# EAGLE design 1-Axis Board - Camera Gantry (EAGLE 6.4)
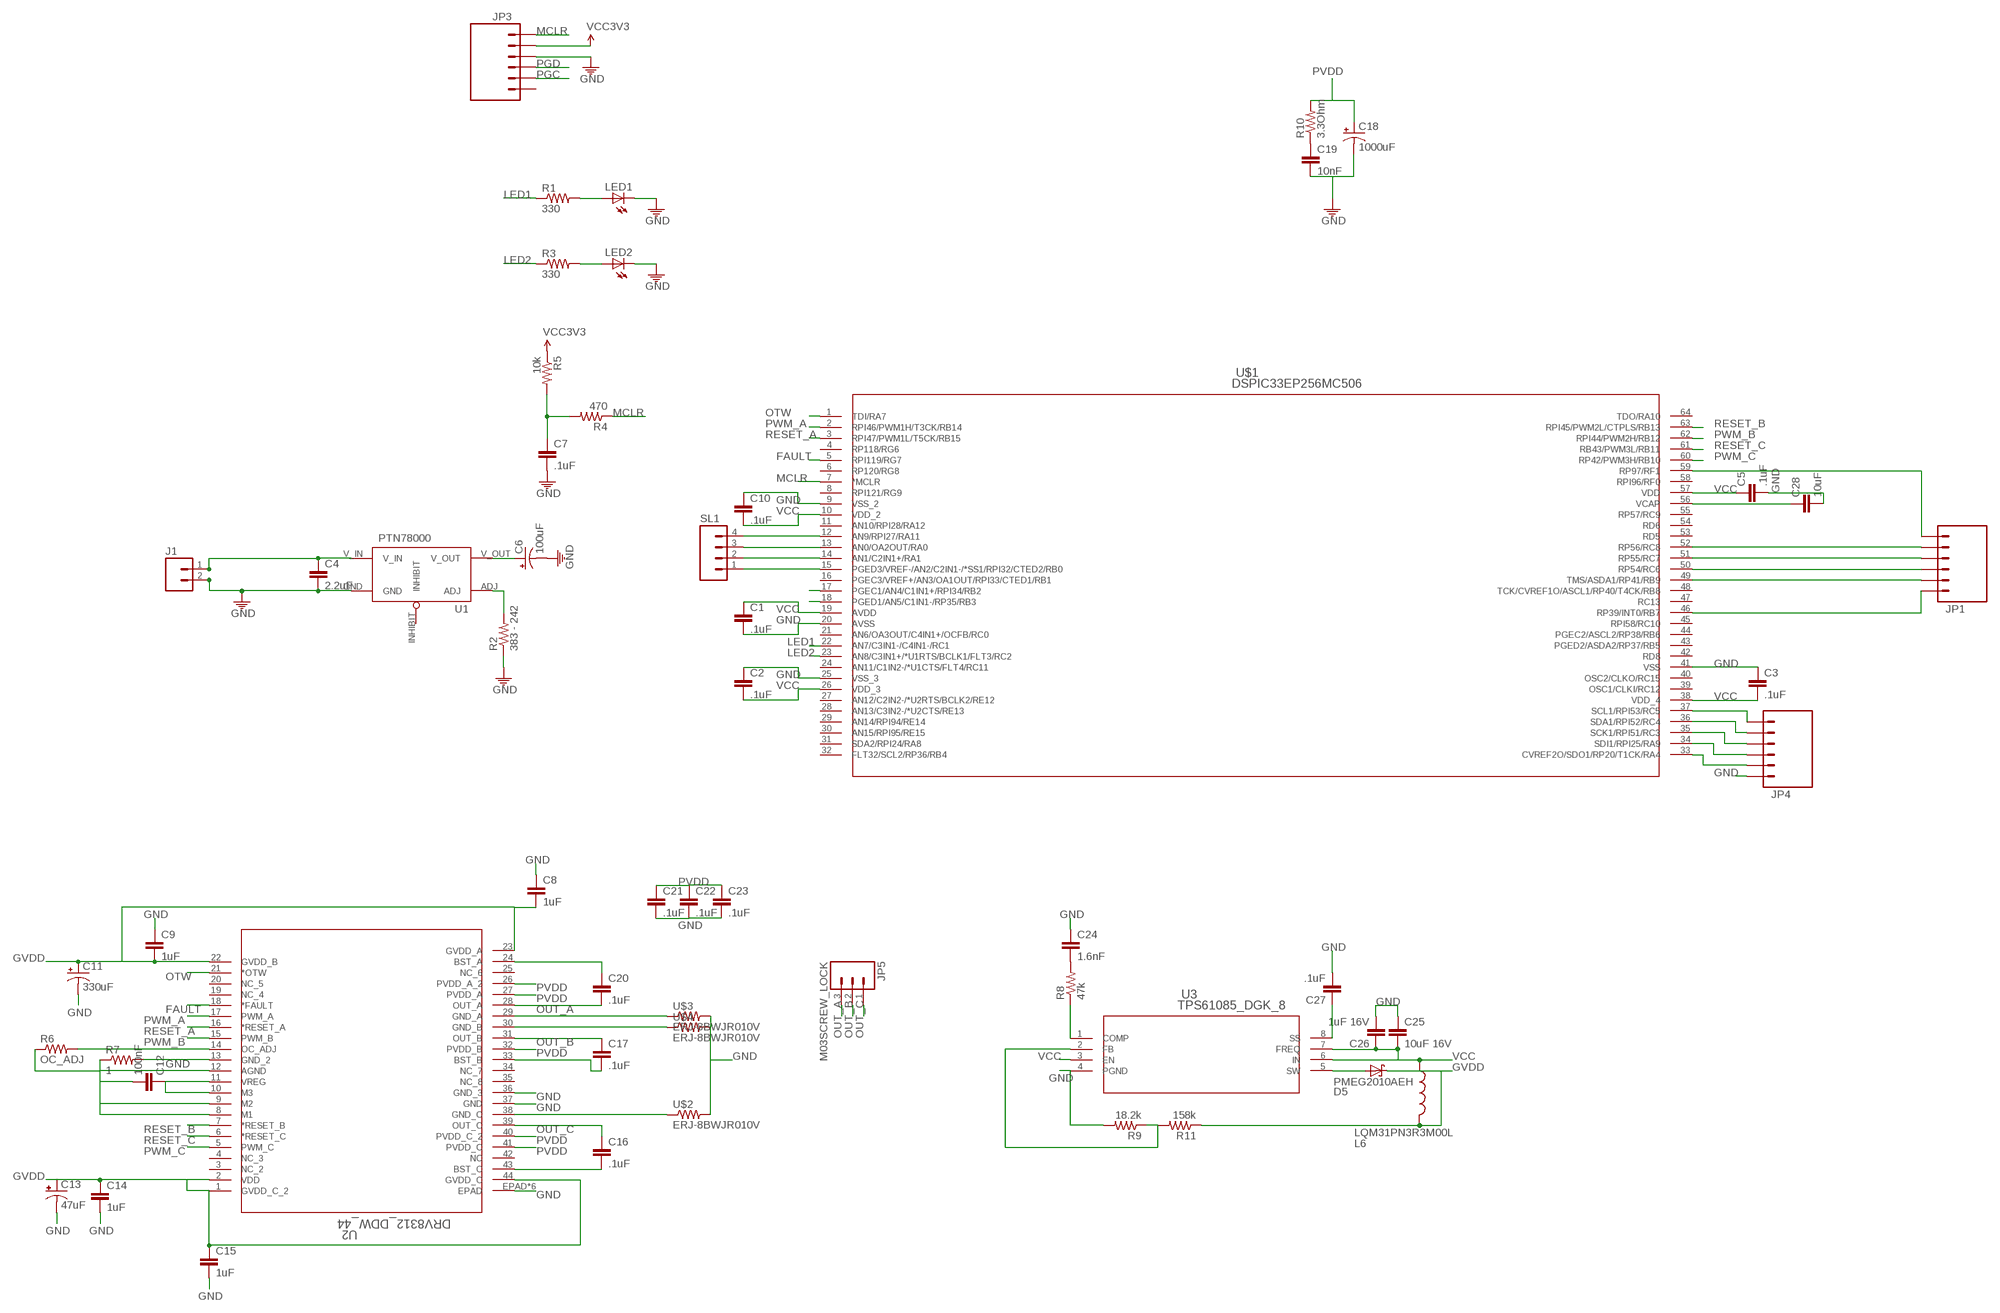
[diagram p0: schematic, sheet 1]

## Parts
C1  .1uF  CAP0805  [0805]
C2  .1uF  CAP0805  [0805]
C3  .1uF  CAP0805  [0805]
C4  2.2uF  CAP1206  [1206]
C5  .1uF  CAP0805  [0805]
C6  100uF  CAP_POLPTH1  [CPOL-RADIAL-100UF-25V]
C7  .1uF  CAP0805  [0805]
C8  1uF  CAP0805  [0805]
C9  1uF  CAP0805  [0805]
C10  .1uF  CAP0805  [0805]
C11  330uF  CAP_POLPTH4  [CPOL-RADIAL-1000UF-25V]
C12  100nF  CAP0805  [0805]
C13  47uF  CAP_POLPTH4  [CPOL-RADIAL-1000UF-25V]
C14  1uF  CAP0805  [0805]
C15  1uF  CAP0805  [0805]
C16  .1uF  CAP0805  [0805]
C17  .1uF  CAP0805  [0805]
C18  1000uF  CAP_POLPTH4  [CPOL-RADIAL-1000UF-25V]
C19  10nF  CAP0805  [0805]
C20  .1uF  CAP0805  [0805]
C21  .1uF  CAP0805  [0805]
C22  .1uF  CAP0805  [0805]
C23  .1uF  CAP0805  [0805]
C24  1.6nF  CAP0805  [0805]
C25  10uF 16V  CAP1206  [1206]
C26  1uF 16V  CAP0805  [0805]
C27  .1uF  CAP0805  [0805]
C28  10uF  CAP1206  [1206]
D5  PMEG2010AEH  [SOD-123]
J1  M023.5MM-NO_SILK  [SCREWTERMINAL-3.5MM-2-NS]
JP1  M06LOCK  [1X06_LOCK]
JP3  M06LOCK  [1X06_LOCK]
JP4  M06LOCK  [1X06_LOCK]
JP5  M03SCREW_LOCK  [SCREWTERMINAL-3.5MM-3_LOCK.007S]
L6  LQM31PN3R3M00L  [1206]
LED1  LED1206  [LED-1206]
LED2  LED1206  [LED-1206]
R1  330  RESISTOR0805-RES  [0805]
R2  383 - 242  RESISTOR0805-RES  [0805]
R3  330  RESISTOR0805-RES  [0805]
R4  470  RESISTOR0805-RES  [0805]
R5  10k  RESISTOR0805-RES  [0805]
R6  OC_ADJ  RESISTOR0805-RES  [0805]
R7  1  RESISTOR0805-RES  [0805]
R8  47k  RESISTOR0805-RES  [0805]
R9  18.2k  RESISTOR0805-RES  [0805]
R10  3.3Ohm  RESISTOR0805-RES  [0805]
R11  158k  RESISTOR0805-RES  [0805]
SL1  M04LOCK  [1X04_LOCK]
U1  PTN78000  PTN78000THROUGH-HOLE  [PTN78000]
U2  DRV8312_DDW_44  [DDW44_8P26X4P31]
U3  TPS61085_DGK_8  [DGK8]
U$1  DSPIC33EP256MC506  [QFP64-10X10MC]
U$2  ERJ-8BWJR010V  [1206]
U$3  ERJ-8BWJR010V  [1206]
U$4  ERJ-8BWJR010V  [1206]

## Nets
FAULT: U2.18(*FAULT) U$1.5(RPI119/RG7)
GND: C1.2 C2.1 C3.1 C4.2 C5.2 C6.2(-) C7.2 C8.1 C9.1 C10.1 C11.2(-) C13.2(-) C14.2 C15.2 C18.2(-) C19.2 C21.2 C22.2 C23.2 C24.1 C25.1 C26.2 C27.2 C28.2 J1.2 JP3.3 JP4.1 LED1.C LED2.C R2.1 R7.2 R9.2 U1.GND U2.13(GND_2) U2.36(GND_3) U2.37(GND) U2.EPAD U2.P$1(EPAD) U2.P$2(EPAD) U2.P$3(EPAD) U2.P$7(EPAD) U2.P$8(EPAD) U3.4(PGND) U$1.9(VSS_2) U$1.20(AVSS) U$1.25(VSS_3) U$1.41(VSS) U$2.2 U$3.2 U$4.2
GVDD: C8.2 C9.2 C11.1(+) C13.1(+) C14.1 C15.1 D5.C L6.2 R11.1 U2.1(GVDD_C_2) U2.2(VDD) U2.22(GVDD_B) U2.23(GVDD_A) U2.44(GVDD_C)
LED1: R1.1 U$1.22(AN7/C3IN1-/C4IN1-/RC1)
LED2: R3.1 U$1.23(AN8/C3IN1+/*U1RTS/BCLK1/FLT3/RC2)
MCLR: JP3.1 R4.1 U$1.7(*MCLR)
N$1: LED1.A R1.2
N$2: C7.1 R4.2 R5.2
N$3: LED2.A R3.2
N$4: U2.38(GND_C) U$2.1
N$5: U2.29(GND_A) U$3.1
N$6 [power]: R2.2 U1.ADJ
N$7: U2.30(GND_B) U$4.1
N$10: C27.1 U3.8(SS)
N$11: R8.1 U3.1(COMP)
N$12: C24.2 R8.2
N$13: C19.1 R10.1
N$14: C28.1 U$1.56(VCAP)
N$15: D5.A U3.5(SW)
N$16: R9.1 R11.2 U3.2(FB)
N$21: C16.2 U2.43(BST_C)
N$23: JP1.1 U$1.46(RP39/INT0/RB7)
N$24: JP1.2 U$1.49(TMS/ASDA1/RP41/RB9)
N$25: JP1.3 U$1.50(RP54/RC6)
N$27: JP1.5 U$1.52(RP56/RC8)
N$28: JP1.6 U$1.59(RP97/RF1)
N$30: C17.2 U2.33(BST_B)
N$32: JP1.4 U$1.51(RP55/RC7)
N$35: JP4.4 U$1.35(SCK1/RPI51/RC3)
N$36: JP4.5 U$1.36(SDA1/RPI52/RC4)
N$37: JP4.6 U$1.37(SCL1/RPI53/RC5)
N$38: JP4.3 U$1.34(SDI1/RPI25/RA9)
N$39: C20.1 U2.24(BST_A)
N$40: SL1.1 U$1.15(PGED3/VREF-/AN2/C2IN1-/*SS1/RPI32/CTED2/RB0)
N$41: SL1.2 U$1.14(AN1/C2IN1+/RA1)
N$42: SL1.3 U$1.13(AN0/OA2OUT/RA0)
N$43: SL1.4 U$1.12(AN9/RPI27/RA11)
N$44: JP4.2 U$1.33(CVREF2O/SDO1/RP20/T1CK/RA4)
N$45: C12.2 R6.1 R7.1 U2.8(M1) U2.9(M2) U2.12(AGND)
N$47: C12.1 U2.10(M3) U2.11(VREG)
OC_ADJ: R6.2 U2.14(OC_ADJ)
OTW: U2.21(*OTW) U$1.1(TDI/RA7)
OUT_A: C20.2 JP5.3 U2.28(OUT_A)
OUT_B: C17.1 JP5.2 U2.31(OUT_B)
OUT_C: C16.1 JP5.1 U2.39(OUT_C)
PGC: JP3.5 U$1.17(PGEC1/AN4/C1IN1+/RPI34/RB2)
PGD [small]: JP3.4 U$1.18(PGED1/AN5/C1IN1-/RP35/RB3)
PVDD [power]: C4.1 C18.1(+) C21.1 C22.1 C23.1 J1.1 R10.2 U1.V_IN U2.26(PVDD_A_2) U2.27(PVDD_A) U2.32(PVDD_B) U2.40(PVDD_C_2) U2.41(PVDD_C)
PWM_A: U2.17(PWM_A) U$1.2(RPI46/PWM1H/T3CK/RB14)
PWM_B: U2.15(PWM_B) U$1.62(RPI44/PWM2H/RB12)
PWM_C: U2.5(PWM_C) U$1.60(RP42/PWM3H/RB10)
RESET_A: U2.16(*RESET_A) U$1.3(RPI47/PWM1L/T5CK/RB15)
RESET_B: U2.7(*RESET_B) U$1.63(RPI45/PWM2L/CTPLS/RB13)
RESET_C: U2.6(*RESET_C) U$1.61(RB43/PWM3L/RB11)
VCC: C1.1 C2.2 C3.2 C5.1 C6.1(+) C10.2 C25.2 C26.1 L6.1 U1.V_OUT U3.3(EN) U3.6(IN) U3.7(FREQ) U$1.10(VDD_2) U$1.19(AVDD) U$1.26(VDD_3) U$1.38(VDD_4) U$1.57(VDD)
VCC3V3: JP3.2 R5.1
Unconnected: JP3.6 U1.INHIBIT U2.3(NC_2) U2.4(NC_3) U2.19(NC_4) U2.20(NC_5) U2.25(NC_6) U2.34(NC_7) U2.35(NC_8) U2.42(NC) U$1.4(RP118/RG6) U$1.6(RP120/RG8) U$1.8(RPI121/RG9) U$1.11(AN10/RPI28/RA12) U$1.16(PGEC3/VREF+/AN3/OA1OUT/RPI33/CTED1/RB1) U$1.21(AN6/OA3OUT/C4IN1+/OCFB/RC0) U$1.24(AN11/C1IN2-/*U1CTS/FLT4/RC11) U$1.27(AN12/C2IN2-/*U2RTS/BCLK2/RE12) U$1.28(AN13/C3IN2-/*U2CTS/RE13) U$1.29(AN14/RPI94/RE14) U$1.30(AN15/RPI95/RE15) U$1.31(SDA2/RPI24/RA8) U$1.32(FLT32/SCL2/RP36/RB4) U$1.39(OSC1/CLKI/RC12) U$1.40(OSC2/CLKO/RC15) U$1.42(RD8) U$1.43(PGED2/ASDA2/RP37/RB5) U$1.44(PGEC2/ASCL2/RP38/RB6) U$1.45(RPI58/RC10) U$1.47(RC13) U$1.48(TCK/CVREF1O/ASCL1/RP40/T4CK/RB8) U$1.53(RD5) U$1.54(RD6) U$1.55(RP57/RC9) U$1.58(RPI96/RF0) U$1.64(TDO/RA10)

## Library data of the parts
C1-C3 C5 C7-C10 C12 C14-C17 C19-C28 = ASL:CAP: Capacitor Standard 0603 ceramic capacitor, and 0.1" leaded capacitor.
C4 = CMPE118lib:CAP: Capacitor Standard 0603 ceramic capacitor, and 0.1" leaded capacitor.
C6 C11 C13 C18 = ASL:CAP_POL: Capacitor Polarized These are standard SMD and PTH capacitors. Normally 10uF, 47uF, and 100uF in electrolytic and tantalum varieties. Always verify the external diameter of the through hole cap, it varies with capacity, voltage, and manufacturer. The EIA devices should be standard.
D5 = DRV83x2Support:PMEG2010AEH
J1 = ASL:M02: Header 2 Standard 2-pin 0.1" header. Use with straight break away headers (SKU : PRT-00116), right angle break away headers (PRT-00553), swiss pins (PRT-00743), machine pins (PRT-00117), and female headers (PRT-00115). Molex polarized connector foot print use with SKU : PRT-08233 with associated crimp pins and housings.
JP1 JP4 = ASL:M06: Header 6 Standard 6-pin 0.1" header. Use with straight break away headers (SKU : PRT-00116), right angle break away headers (PRT-00553), swiss pins (PRT-00743), machine pins (PRT-00117), and female headers (PRT-00115). Molex polarized connector foot print use with SKU : PRT-08094 with associated crimp pins and housings. NOTES ON THE VARIANTS LOCK and LOCK_LONGPADS... This footprint was designed to help hold the alignment of a through-hole component (i.e. 6-pin header) while soldering it into place. You may notice that each hole has been shifted either up or down by 0.005 of an inch from it's more standard position (which is a perfectly straight line). This slight alteration caused the pins (the squares in the middle) to touch the edges of the holes. Because they are alternating, it causes a "brace" to hold the component in place. 0.005 has proven to be the perfect amount of "off-center" position when using our standard breakaway headers. Although looks a little odd when you look at the bare footprint, once you have a header in there, the alteration is very hard to notice. Also, if you push a header all the way into place, it is covered up entirely on the bottom side. This idea of altering the position of holes to aid alignment will be further integrated into the Sparkfun Library for other footprints. It can help hold any component with 3 or more connection pins.
JP3 = CMPE118lib:M06: Header 6 Standard 6-pin 0.1" header. Use with straight break away headers (SKU : PRT-00116), right angle break away headers (PRT-00553), swiss pins (PRT-00743), machine pins (PRT-00117), and female headers (PRT-00115). Molex polarized connector foot print use with SKU : PRT-08094 with associated crimp pins and housings. NOTES ON THE VARIANTS LOCK and LOCK_LONGPADS... This footprint was designed to help hold the alignment of a through-hole component (i.e. 6-pin header) while soldering it into place. You may notice that each hole has been shifted either up or down by 0.005 of an inch from it's more standard position (which is a perfectly straight line). This slight alteration caused the pins (the squares in the middle) to touch the edges of the holes. Because they are alternating, it causes a "brace" to hold the component in place. 0.005 has proven to be the perfect amount of "off-center" position when using our standard breakaway headers. Although looks a little odd when you look at the bare footprint, once you have a header in there, the alteration is very hard to notice. Also, if you push a header all the way into place, it is covered up entirely on the bottom side. This idea of altering the position of holes to aid alignment will be further integrated into the Sparkfun Library for other footprints. It can help hold any component with 3 or more connection pins.
JP5 = ASL:M03: Header 3 Standard 3-pin 0.1" header. Use with straight break away headers (SKU : PRT-00116), right angle break away headers (PRT-00553), swiss pins (PRT-00743), machine pins (PRT-00117), and female headers (PRT-00115). Molex polarized connector foot print use with SKU : PRT-08232 with associated crimp pins and housings.
L6 = DRV83x2Support:LQM31PN3R3M00L
LED1 LED2 = CMPE118lib:LED: LEDs Standard schematic elements and footprints for 5mm, 3mm, 1206, and 0603 sized LEDs. 5mm - Spark Fun Electronics SKU : COM-00529 (and others); COLOR: red
R1-R5 = CMPE118lib:RESISTOR: Resistor Basic schematic elements and footprints for 0603, 1206, and PTH resistors.
R6-R11 = ASL:RESISTOR: Resistor Basic schematic elements and footprints for 0603, 1206, and PTH resistors.
SL1 = ASL:M04: AMP QUICK CONNECTOR
U1 = ASL:PTN78000: This is the PTN78000 part by Texas Instruments. It's a 1.5A adjustable switching regulator.
U2 = DRV83x2Support:DRV8312_DDW_44; DATASHEETURL: http://www.ti.com/lit/gpn/DRV8312; DESCRIPTION: 6.5A Three Phase Brushless DC Motor Driver with Inrush Protection (PWM Ctrl); FAMILY_NAME: 3-PHASE BRUSHLESS DRIVER; GENERIC_PART_NUMBER: DRV8312; INDUSTRY_STD_PKG_TYPE: HTSSOP; MANUFACTURER: Texas Instruments; MANUFACTURER_PART_NUMBER: drv8312_ddw_44; PACKAGE_DESIGNATOR: DDW; PIN_COUNT: 44; VENDOR: Texas Instruments
U3 = DRV83x2Support:TPS61085_DGK_8; DATASHEETURL: http://www.ti.com/lit/gpn/TPS61085; DESCRIPTION: 18.5V, 2A, 650kHz / 1.2MHz Step-Up DC-DC Converter w/ Forced PWM Mode; FAMILY_NAME: STEP-UP REGULATOR; GENERIC_PART_NUMBER: TPS61085; INDUSTRY_STD_PKG_TYPE: MSOP; MANUFACTURER: Texas Instruments; MANUFACTURER_PART_NUMBER: tps61085_dgk_8; PACKAGE_DESIGNATOR: DGK; PIN_COUNT: 8; VENDOR: Texas Instruments
U$1 = DRV83x2Support:DSPIC33EP256MC506
U$2-U$4 = DRV83x2Support:ERJ-8BWJR010V

## Net classes
0 default: width 0.406 mm
1 power: width 0.762 mm, clearance 0.254 mm to class 0, clearance 0.508 mm
2 small: width 0.254 mm, clearance 0.254 mm to class 1

## Board
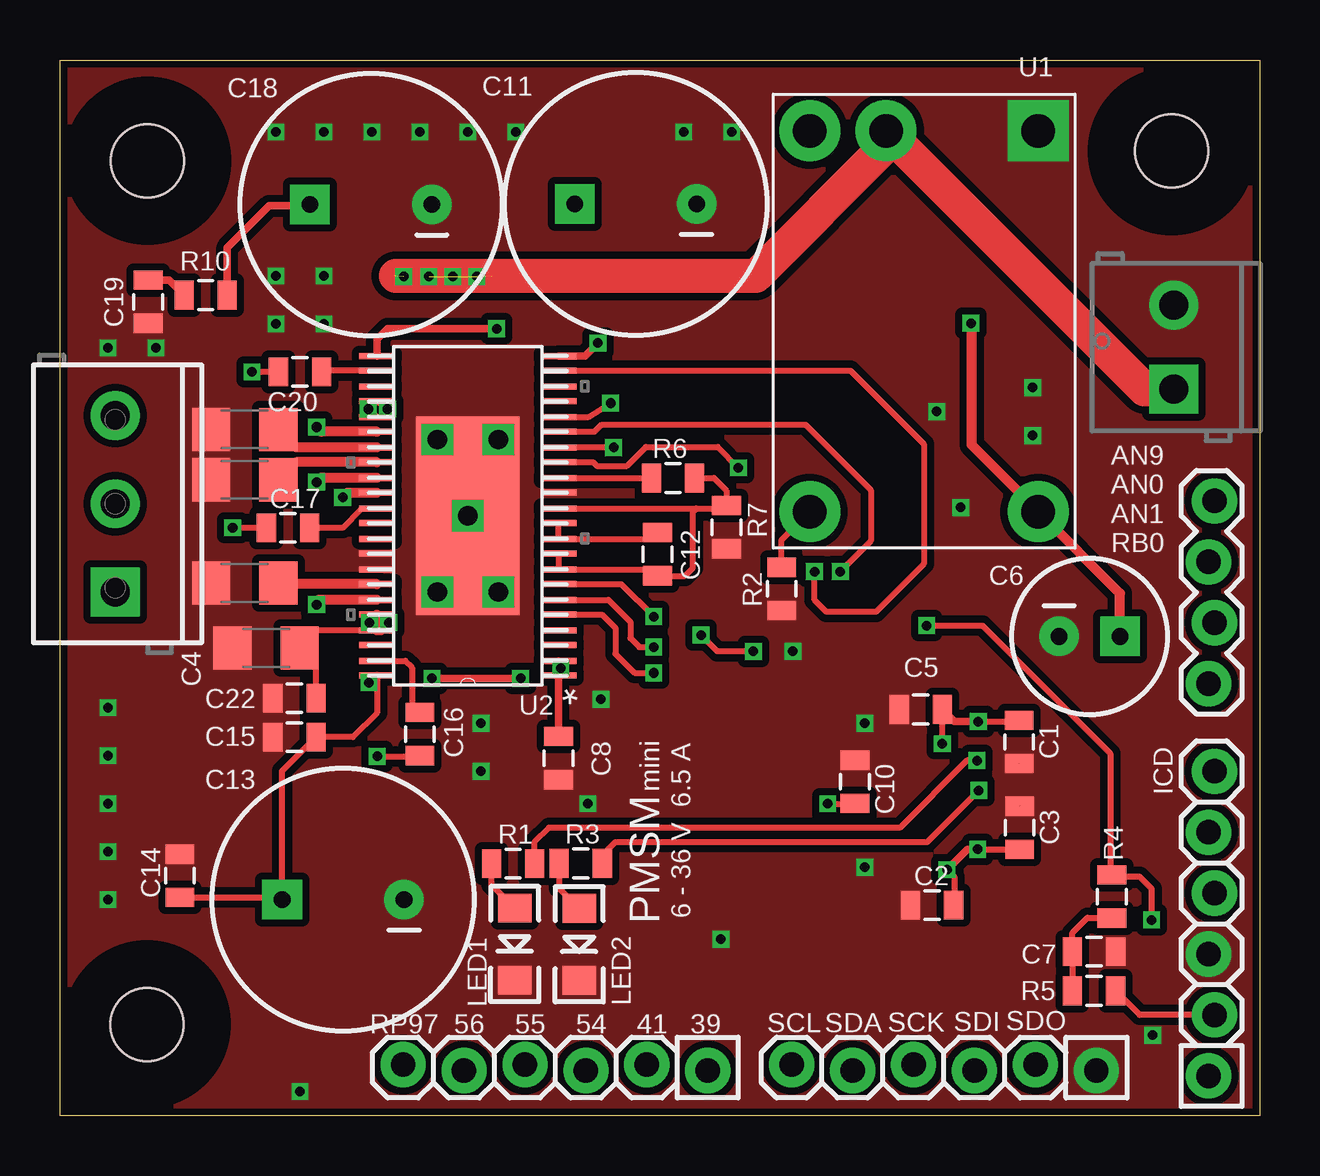
[diagram p1: board, top side]
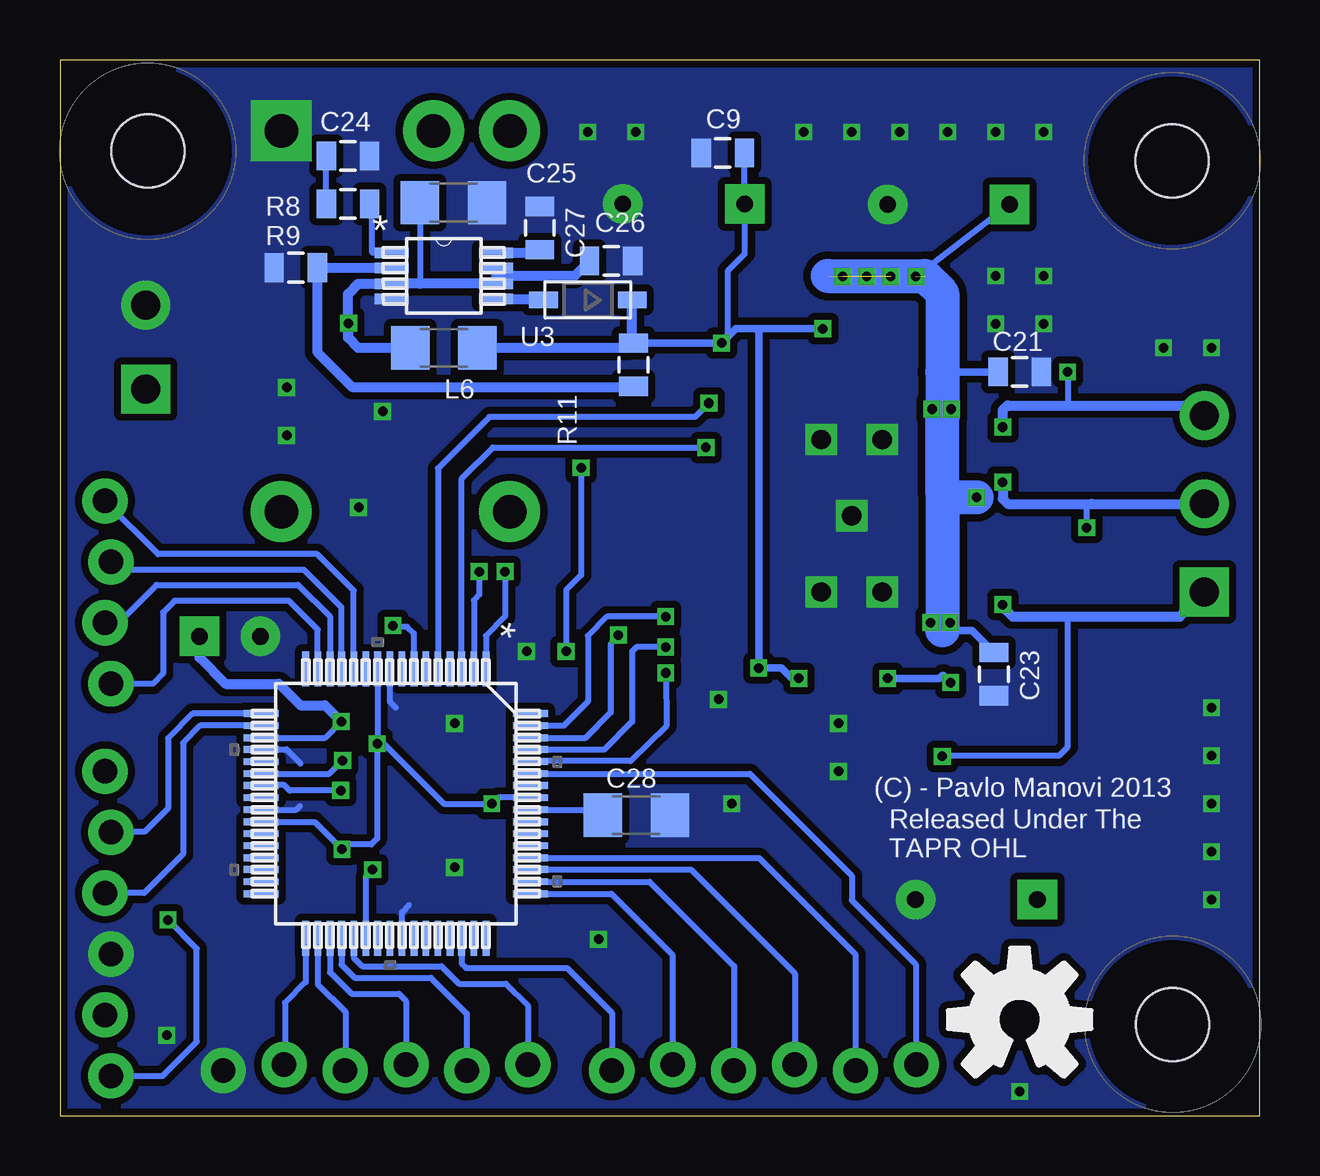
[diagram p2: board, bottom side, seen from below]

Size 50 x 44 mm. Coordinates in mm from the lower left corner, seen from the top.
Outline: 0,0 0,44 50,44 50,0 0,0
Copper layers (1*16): Top 0.035mm / dielectric 1.5mm / Bottom 0.035mm
Design rules "ITEADstudio_DRC": minimum track width 6mil, minimum drill 12mil, track to track 6mil, track to pad 6mil, pad to pad 6mil, via to via 6mil, smd to smd 0mil, copper to edge 10mil, drill to drill 10mil, minimum pad ring 10mil, minimum via ring 6mil, stop-mask expansion 2mil, vias tented up to drill 100mil, thermal gap 10mil

### Footprints (pad centres in the part's own frame; a part is rotated, then mirrored left to right if it is on the bottom)
0805 = smd 0.8 x 1.2: 1 -0.9,0; 2 0.9,0
1206 = smd 1.6 x 1.8: 1 -1.4,0; 2 1.4,0
CPOL-RADIAL-100UF-25V = drill 0.7 pad 1.651 square: 1 1.27,0 | drill 0.7 pad 1.651: 2 -1.27,0
CPOL-RADIAL-1000UF-25V = drill 0.7 pad 1.651 square: 1 2.54,0 | drill 0.7 pad 1.651: 2 -2.54,0
SOD-123 = smd 1.2 x 0.7: A 1.85,0; C -1.85,0
STAND-OFF-TIGHT = hole 3.048: 0,0
SCREWTERMINAL-3.5MM-2-NS = drill 1.2 pad 2.032 square: 1 0,0 | drill 1.2 pad 2.032: 2 3.5,0
1X06_LOCK = drill 1.016 pad 1.88: 1 0,0.127; 2 2.54,-0.127; 3 5.08,0.127; 4 7.62,-0.127; 5 10.16,0.127; 6 12.7,-0.127
SCREWTERMINAL-3.5MM-3_LOCK.007S = drill 1.2 pad 2.032 square: 1 -0.178,0 | drill 1.2 pad 2.032: 2 3.5,0; 3 7.178,0
LED-1206 = smd 1.2 x 1.4: A -1.5,0; C 1.5,0
1X04_LOCK = drill 1.016 pad 1.88: 1 0,0.127; 2 2.54,-0.127; 3 5.08,0.127; 4 7.62,-0.127
PTN78000 = drill 1.397 pad 2.54: ADJ 15.875,-9.525; INHIBIT 0,-9.525; V_IN 0,-6.35; V_OUT 15.875,0 | drill 1.397 pad 2.54 square: GND 0,0
DDW44_8P26X4P31 = smd 1.473 x 0.254: 1 -3.785,6.655; 2 -3.785,6.045; 3 -3.785,5.385; 4 -3.785,4.775; 5 -3.785,4.115; 6 -3.785,3.505; 7 -3.785,2.845; 8 -3.785,2.235; 9 -3.785,1.575; 10 -3.785,0.965; 11 -3.785,0.305; 12 -3.785,-0.305; 13 -3.785,-0.965; 14 -3.785,-1.575; 15 -3.785,-2.235; 16 -3.785,-2.845; 17 -3.785,-3.505; 18 -3.785,-4.115; 19 -3.785,-4.775; 20 -3.785,-5.385; 21 -3.785,-6.045; 22 -3.785,-6.655; 23 3.785,-6.655; 24 3.785,-6.045; 25 3.785,-5.385; 26 3.785,-4.775; 27 3.785,-4.115; 28 3.785,-3.505; 29 3.785,-2.845; 30 3.785,-2.235; 31 3.785,-1.575; 32 3.785,-0.965; 33 3.785,-0.305; 34 3.785,0.305; 35 3.785,0.965; 36 3.785,1.575; 37 3.785,2.235; 38 3.785,2.845; 39 3.785,3.505; 40 3.785,4.115; 41 3.785,4.775; 42 3.785,5.385; 43 3.785,6.045; 44 3.785,6.655 | smd 4.318 x 8.255: EPAD 0,0 | drill 0.8 square: P$1 -1.27,3.175; P$2 1.27,3.175; P$3 0,0; P$7 1.27,-3.175; P$8 -1.27,-3.175
DGK8 = smd 1.422 x 0.432: 1 -2.184,0.965; 2 -2.184,0.33; 3 -2.184,-0.33; 4 -2.184,-0.965; 5 2.184,-0.965; 6 2.184,-0.33; 7 2.184,0.33; 8 2.184,0.965
QFP64-10X10MC = smd 1.473 x 0.279: 1 -5.613,3.759; 2 -5.613,3.251; 3 -5.613,2.743; 4 -5.613,2.261; 5 -5.613,1.753; 6 -5.613,1.245; 7 -5.613,0.762; 8 -5.613,0.254; 9 -5.613,-0.254; 10 -5.613,-0.762; 11 -5.613,-1.245; 12 -5.613,-1.753; 13 -5.613,-2.261; 14 -5.613,-2.743; 15 -5.613,-3.251; 16 -5.613,-3.759; 33 5.613,-3.759; 34 5.613,-3.251; 35 5.613,-2.743; 36 5.613,-2.261; 37 5.613,-1.753; 38 5.613,-1.245; 39 5.613,-0.762; 40 5.613,-0.254; 41 5.613,0.254; 42 5.613,0.762; 43 5.613,1.245; 44 5.613,1.753; 45 5.613,2.261; 46 5.613,2.743; 47 5.613,3.251; 48 5.613,3.759 | smd 0.279 x 1.473: 17 -3.759,-5.613; 18 -3.251,-5.613; 19 -2.743,-5.613; 20 -2.261,-5.613; 21 -1.753,-5.613; 22 -1.245,-5.613; 23 -0.762,-5.613; 24 -0.254,-5.613; 25 0.254,-5.613; 26 0.762,-5.613; 27 1.245,-5.613; 28 1.753,-5.613; 29 2.261,-5.613; 30 2.743,-5.613; 31 3.251,-5.613; 32 3.759,-5.613; 49 3.759,5.613; 50 3.251,5.613; 51 2.743,5.613; 52 2.261,5.613; 53 1.753,5.613; 54 1.245,5.613; 55 0.762,5.613; 56 0.254,5.613; 57 -0.254,5.613; 58 -0.762,5.613; 59 -1.245,5.613; 60 -1.753,5.613; 61 -2.261,5.613; 62 -2.743,5.613; 63 -3.251,5.613; 64 -3.759,5.613

### Placement (x,y rotation side)
C1  39.98,15.57 270 top
C2  36.35,8.78 0 top
C3  40,12 270 top
C4  8.59,19.49 180 top
C5  35.88,16.93 180 top
C6  42.92,19.97 0 top
C7  43.1,6.84 0 top
C8  20.77,14.9 90 top
C9  22.38,40.12 0 bottom
C10  33.13,13.91 270 top
C11  24,38 180 top
C12  24.9,23.4 270 top
C13  11.8,9 180 top
C14  5,10 90 top
C15  9.77,15.77 180 top
C16  15,15.9 90 top
C17  9.5,24.5 0 top
C18  12.96,37.98 180 top
C19  3.67,33.92 270 top
C20  10,31 180 top
C21  10,31 0 bottom
C22  9.77,17.4 180 top
C23  11.08,18.4 270 bottom
C24  38,40 180 bottom
C25  33.6,38.05 180 bottom
C26  27.02,35.62 0 bottom
C27  30,37 90 bottom
C28  25.98,12.53 0 bottom
D5  28,34 180 bottom
E$1  [STAND-OFF-TIGHT]  46.34,40.2 0 top
E$3  [STAND-OFF-TIGHT]  3.62,3.8 0 top
E$4  [STAND-OFF-TIGHT]  3.64,39.8 0 top
J1  46.43,30.28 90 top
JP1  27,2 180 top
JP3  48,1.65 90 top
JP4  43.2,2 180 top
JP5  2.3,22 90 top
L6  34,32 0 bottom
LED1  18.95,7.15 270 top
LED2  21.64,7.13 270 top
R1  18.88,10.5 180 top
R2  30.08,21.95 90 top
R3  21.7,10.51 180 top
R4  43.84,9.13 270 top
R5  43.1,5.2 180 top
R6  25.55,26.57 180 top
R7  27.77,24.52 270 top
R8  38,38 180 bottom
R9  40.17,35.35 180 bottom
R10  6.07,34.2 0 top
R11  26.1,31.3 270 bottom
SL1  48,18 90 top
U1  40.78,41.05 270 top
U2  17,25 180 top
U3  34,35 0 bottom
U$1  36,13 270 bottom
U$2  7.7,22.2 180 top
U$3  7.7,28.6 180 top
U$4  7.7,26.5 180 top

### Tracks (layer width: path | path; a pad name or v marks a point on that pad's centre or on a via)
FAULT  (via drill 0.4)
  Top 0.254: U2.18 22.04,29.11 v22.95,29.7
  Bottom 0.254: U$1.5 34.25,26.98 32.1,29.12 23.52,29.12 v22.95,29.7
GND  (via drill 0.4)  (2 unrouted)
  Bottom 0.254: U$1.20 40.56,15.26 C1.2 | U$1.25 40.15,12.75 C3.1 | U$1.41 35.75,8.48 C2.1 | U$1.9 36.25,17.25 36,17
  other vias: 11,41 13,41 15,41 9,41 17,41 19,41 26,41 28,41 11,35 9,35 9,33 11,33 2,32 4,32 2,17 2,15 2,13 2,11 2,9 10,1 45.55,3.35 40.55,28.35 40.55,30.35 36.55,29.35 37.55,25.35 30.55,19.35 33.55,16.35 33.55,10.35 27.55,7.35 17.55,16.35 17.55,14.35 22.55,17.35 22,13
  pour Top (isolate 0.305, no thermals): 0,44 50,44 50,0 0,0
  pour Bottom (isolate 0.305, no thermals): 0,44 50,44 50,0 0,0
GVDD  (via drill 0.4)
  Top 0.254: U2.44 13.22,16.79 12.2,15.77 C15.1 9.26,14.36 C13.1 9.16,9.1 C14.1
  Top 0.305: U2.22 21.88,31.66 v22.42,32.2 | U2.23 13.22,32.37 13.65,32.8 v18.2,32.8 | C8.2 U2.2 | U2.1 U2.2 | v12.88,18.05 12.92,18.05 U2.44 | v20.88,18.65 20.88,18.86 U2.2 | v19.2,18.23 v15.5,18.23
  Bottom 0.254: C9.2 21.46,40.11 C11.1 21.45,35.92 22.15,35.23 22.15,32.48
  Bottom 0.305: v22.42,32.2 R11.1 | 22.15,32.48 v22.42,32.2 | v18.2,32.8 21,32.8 | 21,32.8 21.83,32.8 v22.42,32.2 | v19.2,18.23 19.5,18.23 19.92,18.65 v20.88,18.65 20.88,32.67 21,32.8 | v15.5,18.23 13.34,18.23 U2.44 13.17,18.34 v12.88,18.05
  Bottom 0.406: D5.C 26.15,32.25 R11.1 26.3,32 L6.2
LED1  (via drill 0.4)
  Top 0.254: v38.23,14.8 37.8,14.8 35,12 20.38,12 19.78,11.41 R1.1
  Bottom 0.254: U$1.22 38.78,14.25 v38.23,14.8
LED2  (via drill 0.4)
  Top 0.254: R3.1 22.6,10.86 23.15,11.4 36.15,11.4 v38.3,13.55
  Bottom 0.254: v38.3,13.55 40.42,13.55 40.65,13.78 41.6,13.78 U$1.23
MCLR  (via drill 0.4)
  Top 0.254: v45.5,8.15 45.5,9.45 45,9.95 43.92,9.95 R4.1 43.78,10.1 43.78,15.1 38.45,20.43 v36.12,20.43
  Bottom 0.254: JP3.1 45.72,1.65 44.3,3.08 44.3,6.95 v45.5,8.15 | U$1.7 35.25,18.62 35.25,20.1 35.52,20.38 36.08,20.38 v36.12,20.43
N$1
  Top 0.254: LED1.A 17.98,9.62 R1.2
N$2
  Top 0.254: R5.2 C7.1 42.2,7.62 42.83,8.25 43.82,8.25 R4.2
N$3
  Top 0.254: R3.2 20.8,9.47 LED2.A
N$4
  Top 0.406: U2.38 9.14,22.16 U$2.1
N$5
  Top 0.406: U2.29 9.86,27.84 U$3.1
N$6
  Top 0.254: R2.2 30.08,24 U1.ADJ
N$7
  Top 0.406: U2.30 9.84,27.23 U$4.1
N$8
  Bottom 0.2: 9.21,2.09 arc-9 8.91,2.25 8.15,1.64 7.64,2.15 8.25,2.91 arc-19 7.99,3.54 7.02,3.63 7.02,4.37 7.99,4.46 arc-19 8.25,5.09 7.64,5.85 8.15,6.36 8.91,5.75 arc-19 9.54,6.01 9.63,6.98 10.37,6.98 10.46,6.01 arc-19 11.09,5.75 11.85,6.36 12.36,5.85 11.75,5.09 arc-19 12.01,4.46 12.98,4.37 12.98,3.63 12.01,3.54 arc-19 11.75,2.91 12.36,2.15 11.85,1.64 11.09,2.25 arc-9 10.79,2.09 10.36,3.13 arc68 10.94,4 arc248 9.64,3.13 9.21,2.09
N$10
  Bottom 0.406: U3.8 30.13,35.97 C27.1
N$11
  Bottom 0.254: U3.1 36.97,35.97 37,36 37,37.9 R8.1
N$12
  Bottom 0.254: R8.2 C24.2
N$13
  Top 0.305: C19.1 4.56,34.82 R10.1
N$14
  Bottom 0.254: U$1.56 27.65,12.75 C28.1
N$15
  Bottom 0.406: U3.5 29.88,34.03 D5.A
N$16
  Bottom 0.406: U3.2 39.26,35.33 R9.1 39.27,31.83 37.83,30.38 26.12,30.38 R11.2
N$21
  Top 0.254: U2.43 14.4,18.95 14.67,18.68 14.67,17.12 C16.2
N$23
  Bottom 0.254: U$1.46 33.26,6.33 33.08,6.15 28.88,6.15 27,4.28 JP1.1
N$24
  Bottom 0.254: U$1.49 27.02,9.24 24.48,6.7 24.48,2.14 JP1.2
N$25
  Bottom 0.254: U$1.50 25.42,9.75 21.9,6.22 21.9,1.89 JP1.3
N$27
  Bottom 0.254: U$1.52 20.86,10.74 16.85,6.72 16.85,1.88 JP1.5
N$28
  Bottom 0.254: U$1.59 21.24,14.25 17,10 17,8.97 14.33,6.3 14.33,2.15 JP1.6
N$30
  Top 0.254: C17.2 11.77,24.5 12.58,25.3 U2.33
N$32
  Bottom 0.254: U$1.51 23.71,10.26 19.38,5.92 JP1.4
N$35
  Bottom 0.254: U$1.35 38.74,5.97 37.85,5.08 35.88,5.08 35.58,4.78 JP4.4
N$36
  Bottom 0.254: U$1.36 38.26,6.29 37.73,5.75 34.55,5.75 33.05,4.25 33.05,1.88 JP4.5
N$37
  Bottom 0.254: U$1.37 37.75,6.58 37.4,6.22 34.1,6.22 33.38,5.5 31.42,5.5 30.5,4.58 JP4.6
N$38
  Bottom 0.254: U$1.34 39.25,5.48 38.1,4.33 38.1,1.89 JP4.3
N$39
  Top 0.254: U2.24 10.95,31.05 C20.1
N$40
  Bottom 0.254: U$1.15 39.25,20.25 40.45,21.45 45.22,21.45 45.7,20.98 45.7,18.43 46.12,18 SL1.1
N$41
  Bottom 0.254: SL1.2 47.56,20.54 45.97,22.12 40.08,22.12 38.75,20.8 U$1.14
N$42
  Bottom 0.254: U$1.13 38.26,21.19 39.83,22.75 47.54,22.75 SL1.3
N$43
  Bottom 0.254: U$1.12 37.75,21.88 39.27,23.4 45.91,23.4 SL1.4
N$44
  Bottom 0.254: U$1.33 39.76,5.57 40.62,4.7 40.62,2.16 JP4.2
N$45
  Top 0.254: U2.9 U2.8 24.63,22.77 C12.2 26.05,22.5 26.38,22.82 26.38,25.16 26.52,25.3 | R6.1 27.25,26.57 27.77,26.05 R7.1 27.66,25.3 26.52,25.3 | U2.12 26.52,25.3
N$47
  Top 0.254: C12.1 24.63,24.04 U2.10 U2.11
OC_ADJ
  Top 0.254: U2.14 R6.2 | R6.2
OTW  (via drill 0.4)
  Top 0.254: U2.21 32.95,31.05 36,28 36,23 34,21 31.95,21 31.45,21.5 v31.45,22.68
  Bottom 0.254: v31.45,22.68 31.45,20.8 32.25,20 32.25,18.62 U$1.1
OUT_A  (via drill 0.4)
  Top 0.254: C20.2 v8,31
  Top 0.406: U2.28 10.89,28.5 v10.7,28.7
  Bottom 0.254: v8,31 8,29.6
  Bottom 0.406: v10.7,28.7 10.7,29.4 10.5,29.6 8,29.6 2.72,29.6 JP5.3
OUT_B  (via drill 0.4)
  Top 0.254: C17.1 v7.2,24.5
  Top 0.406: U2.31 10.88,26.57 v10.7,26.4
  Bottom 0.254: v7.2,24.5 7.2,25.3 7,25.5
  Bottom 0.406: v10.7,26.4 10.7,25.7 10.5,25.5 7,25.5 JP5.2
OUT_C  (via drill 0.4)
  Top 0.254: v13.23,14.98 14.98,14.98 C16.1
  Top 0.406: U2.39 10.8,21.5 v10.7,21.3
  Bottom 0.254: 8,20.8 8,15.38 8.38,15 13.2,15 v13.23,14.98
  Bottom 0.406: v10.7,21.3 10.7,21.2 10.3,20.8 8,20.8 3.32,20.8 JP5.1
PGC
  Bottom 0.254: U$1.17 44.47,16.76 45.5,15.73 45.5,12.8 46.47,11.82 47.86,11.82 JP3.5
PGD
  Bottom 0.254: U$1.18 44.15,16.25 44.88,15.52 44.88,10.9 46.5,9.28 JP3.4
PVDD  (via drill 0.4)  (7 unrouted)
  Top 0.254: U2.41 10.73,20.23 C4.1 10.68,18.8 C22.1 | v13.65,29.45 13.54,29.45 U2.26 12.89,29.45 v12.85,29.45 12.88,29.45 U2.27
  Top 0.305: R10.2 6.97,36.17 8.73,37.92 10.37,37.92 C18.1
  Top 0.406: v11.79,25.77 11.99,25.96 U2.32 | v12.9,20.55 12.9,20.57 U2.40 U2.41 13.38,20.23 v13.7,20.55
  Top 1.422: J1.1 45.2,30.28 U1.V_IN 34.43,40.43 29,35 14,35
  Bottom 0.254: C18.1 v14.33,34.98
  Bottom 0.305: C23.1 | C23.1 12,20.23 U2.41 | C21.1 13.23,31
  Bottom 1.422: 18,35 13.95,35 13.23,34.27 13.23,31 U2.27 | 13.23,26 13.23,20.23 U2.41 | v11.79,25.77 12.99,25.77 13.23,26 | 13.23,26 U2.27 | U2.27
  other vias: 15.38,34.98 16.38,34.98 17.38,34.98
PWM_A  (via drill 0.4)
  Top 0.254: U2.17 22.28,28.5 22.58,28.8 31.08,28.8 33.8,26.07 33.8,23.95 v32.52,22.68
  Bottom 0.254: v32.52,22.68 32.52,21.7 32.75,21.48 U$1.2
PWM_B  (via drill 0.4)
  Top 0.254: U2.15 22.22,27.23 22.38,27.07 23.62,27.07 24.42,27.88 27.42,27.88 v28.27,27 | v28.9,19.35 27.4,19.35 v26.73,20.02
  Bottom 0.254: v26.73,20.02 26.73,19.98 27.05,19.65 27.05,16.8 28.12,15.73 30.37,15.73 U$1.62 | v28.27,27 28.27,22.52 28.9,21.9 v28.9,19.35
PWM_C  (via drill 0.4)
  Top 0.254: U2.5 22.59,20.89 23.15,20.32 23.15,19.25 23.95,18.45 v24.75,18.45
  Bottom 0.254: v24.75,18.45 24.73,16.25 26.23,14.77 30.36,14.77 U$1.60
RESET_A  (via drill 0.4)
  Top 0.254: v23.08,27.85 U2.16
  Bottom 0.254: U$1.3 33.26,26.54 31.95,27.85 v23.08,27.85
RESET_B  (via drill 0.4)
  Top 0.254: U2.7 23.4,22.16 v24.75,20.8
  Bottom 0.254: U$1.63 29,16.25 28,17.25 28,20 27.2,20.8 v24.75,20.8
RESET_C  (via drill 0.4)
  Top 0.254: U2.6 22.85,21.5 23.77,20.57 23.77,19.9 24.15,19.52 v24.75,19.52
  Bottom 0.254: 30.37,15.27 U$1.61 30.38,15.25 27.33,15.25 26.15,16.43 26.15,19.35 25.98,19.52 v24.75,19.52
VCC  (via drill 0.4)
  Top 0.254: v32,13 C10.2 | v36.77,15.5 C5.1 | v38.27,16.43 39.92,16.43 C1.1 | v38.25,11.1 C3.2 | v36.98,10.25 37.27,9.95 37.27,8.8 C2.2
  Top 0.305: 40.05,16.4 C1.1 | v38.27,16.43 37.27,16.43 C5.1 | v38.25,11.1 37.83,11.1 v36.98,10.25
  Top 0.406: v37.98,33.02 38,33 38,27.95 U1.V_OUT 44.19,21.77 C6.1
  Bottom 0.254: U$1.57 31.75,13.25 v32,13 34,13 36.5,15.5 v36.77,15.5 | U$1.10 36.76,15.51 v36.77,15.5 | U$1.19 38.96,15.74 v38.27,16.43 | U$1.26 39.39,12.24 v38.25,11.1 38.05,11.3 37.02,11.3 36.77,11.55 v36.77,15.5 | U$1.38 C2.2 37.25,9.97 v36.98,10.25 | C25.2 35,34.67
  Bottom 0.406: U3.6 31.63,34.67 31.3,35 28.55,35 C26.1 | U3.7 U3.6 | U3.6 31.5,34.98 31.5,35.1 31.6,35.1 32.03,34.67 35,34.67 U3.3 37.58,34.67 38,34.25 38,32.42 | L6.1 37.58,32 38,32.42 | 38,32.42 37.98,32.45 v37.98,33.02 | C6.1 44.19,19.09 43.1,18 40.88,18 39.98,17.1 38.95,17.1 v38.27,16.43
VCC3V3
  Top 0.254: JP3.2 45.01,4.19 R5.1

### Text on the board
tNames: AN9 / AN0 / AN1 / RB0 | mini | ICD | PMSM | 6 - 36 V 6.5 A | SCK | SDI | SDO | RP97 56 55 54 41 39 | SCL | SDA
bNames: (C) - Pavlo Manovi 2013 | Released Under The / TAPR OHL